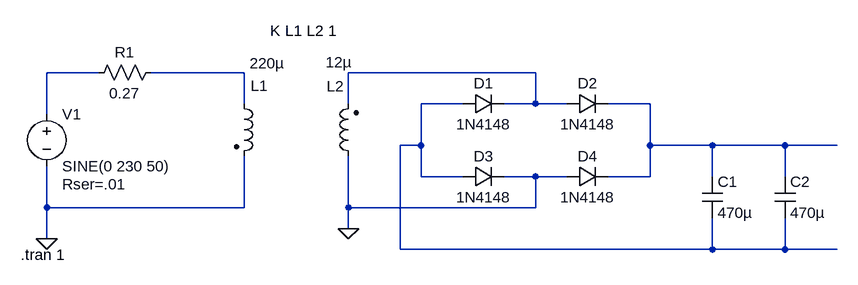
[diagram p0: schematic AC-DC.asc]
AC-DC.asc, the LTspice schematic file:
Version 4
SHEET 1 1396 680
WIRE 256 -96 176 -96
WIRE 480 -96 336 -96
WIRE 928 -96 640 -96
WIRE 480 -48 480 -96
WIRE 640 -48 640 -96
WIRE 816 -48 752 -48
WIRE 928 -48 928 -96
WIRE 928 -48 880 -48
WIRE 976 -48 928 -48
WIRE 1104 -48 1040 -48
WIRE 176 -32 176 -96
WIRE 752 16 752 -48
WIRE 752 16 720 16
WIRE 1104 16 1104 -48
WIRE 1200 16 1104 16
WIRE 1312 16 1200 16
WIRE 1392 16 1312 16
WIRE 752 64 752 16
WIRE 816 64 752 64
WIRE 928 64 880 64
WIRE 976 64 928 64
WIRE 1104 64 1104 16
WIRE 1104 64 1040 64
WIRE 1200 64 1200 16
WIRE 1312 64 1312 16
WIRE 176 112 176 48
WIRE 480 112 480 32
WIRE 480 112 176 112
WIRE 640 112 640 32
WIRE 928 112 928 64
WIRE 928 112 640 112
WIRE 640 144 640 112
WIRE 176 160 176 112
WIRE 720 176 720 16
WIRE 1200 176 1200 128
WIRE 1200 176 720 176
WIRE 1312 176 1312 128
WIRE 1312 176 1200 176
WIRE 1392 176 1312 176
FLAG 176 160 0
FLAG 640 144 0
SYMBOL voltage 176 -48 R0
WINDOW 123 0 0 Left 0
WINDOW 39 24 124 Left 2
SYMATTR InstName V1
SYMATTR Value SINE(0 230 50)
SYMATTR SpiceLine Rser=.01
SYMBOL res 352 -112 R90
WINDOW 0 0 56 VBottom 2
WINDOW 3 32 56 VTop 2
SYMATTR InstName R1
SYMATTR Value 0.27
SYMBOL ind2 464 -64 R0
WINDOW 0 26 -12 Left 2
WINDOW 3 24 -46 Left 2
SYMATTR InstName L1
SYMATTR Value 220µ
SYMATTR Type ind
SYMBOL ind2 656 48 R180
WINDOW 0 22 123 Left 2
WINDOW 3 10 160 Left 2
SYMATTR InstName L2
SYMATTR Value 12µ
SYMATTR Type ind
SYMBOL diode 816 -32 R270
WINDOW 0 32 32 VTop 2
WINDOW 3 0 32 VBottom 2
SYMATTR InstName D1
SYMATTR Value 1N4148
SYMBOL diode 976 -32 R270
WINDOW 0 32 32 VTop 2
WINDOW 3 0 32 VBottom 2
SYMATTR InstName D2
SYMATTR Value 1N4148
SYMBOL diode 816 80 R270
WINDOW 0 32 32 VTop 2
WINDOW 3 0 32 VBottom 2
SYMATTR InstName D3
SYMATTR Value 1N4148
SYMBOL diode 976 80 R270
WINDOW 0 32 32 VTop 2
WINDOW 3 0 32 VBottom 2
SYMATTR InstName D4
SYMATTR Value 1N4148
SYMBOL cap 1184 64 R0
SYMATTR InstName C1
SYMATTR Value 470µ
SYMBOL cap 1296 64 R0
SYMATTR InstName C2
SYMATTR Value 470µ
TEXT 520 -160 Left 2 !K L1 L2 1
TEXT 136 184 Left 2 !.tran 1

The netlist it stands for:
* AC-DC.asc
V1 N001 0 SINE(0 230 50) Rser=.01
R1 N002 N001 0.27
L1 N002 0 220µ
L2 0 N003 12µ
D1 N004 N003 1N4148
D2 N003 N005 1N4148
D3 N004 0 1N4148
D4 0 N005 1N4148
C1 N005 N004 470µ
C2 N005 N004 470µ
.model D D
.lib standard.dio
K L1 L2 1
.tran 1
.backanno
.end